# Altium schematic sheet Address Termination.SchDoc
size A3
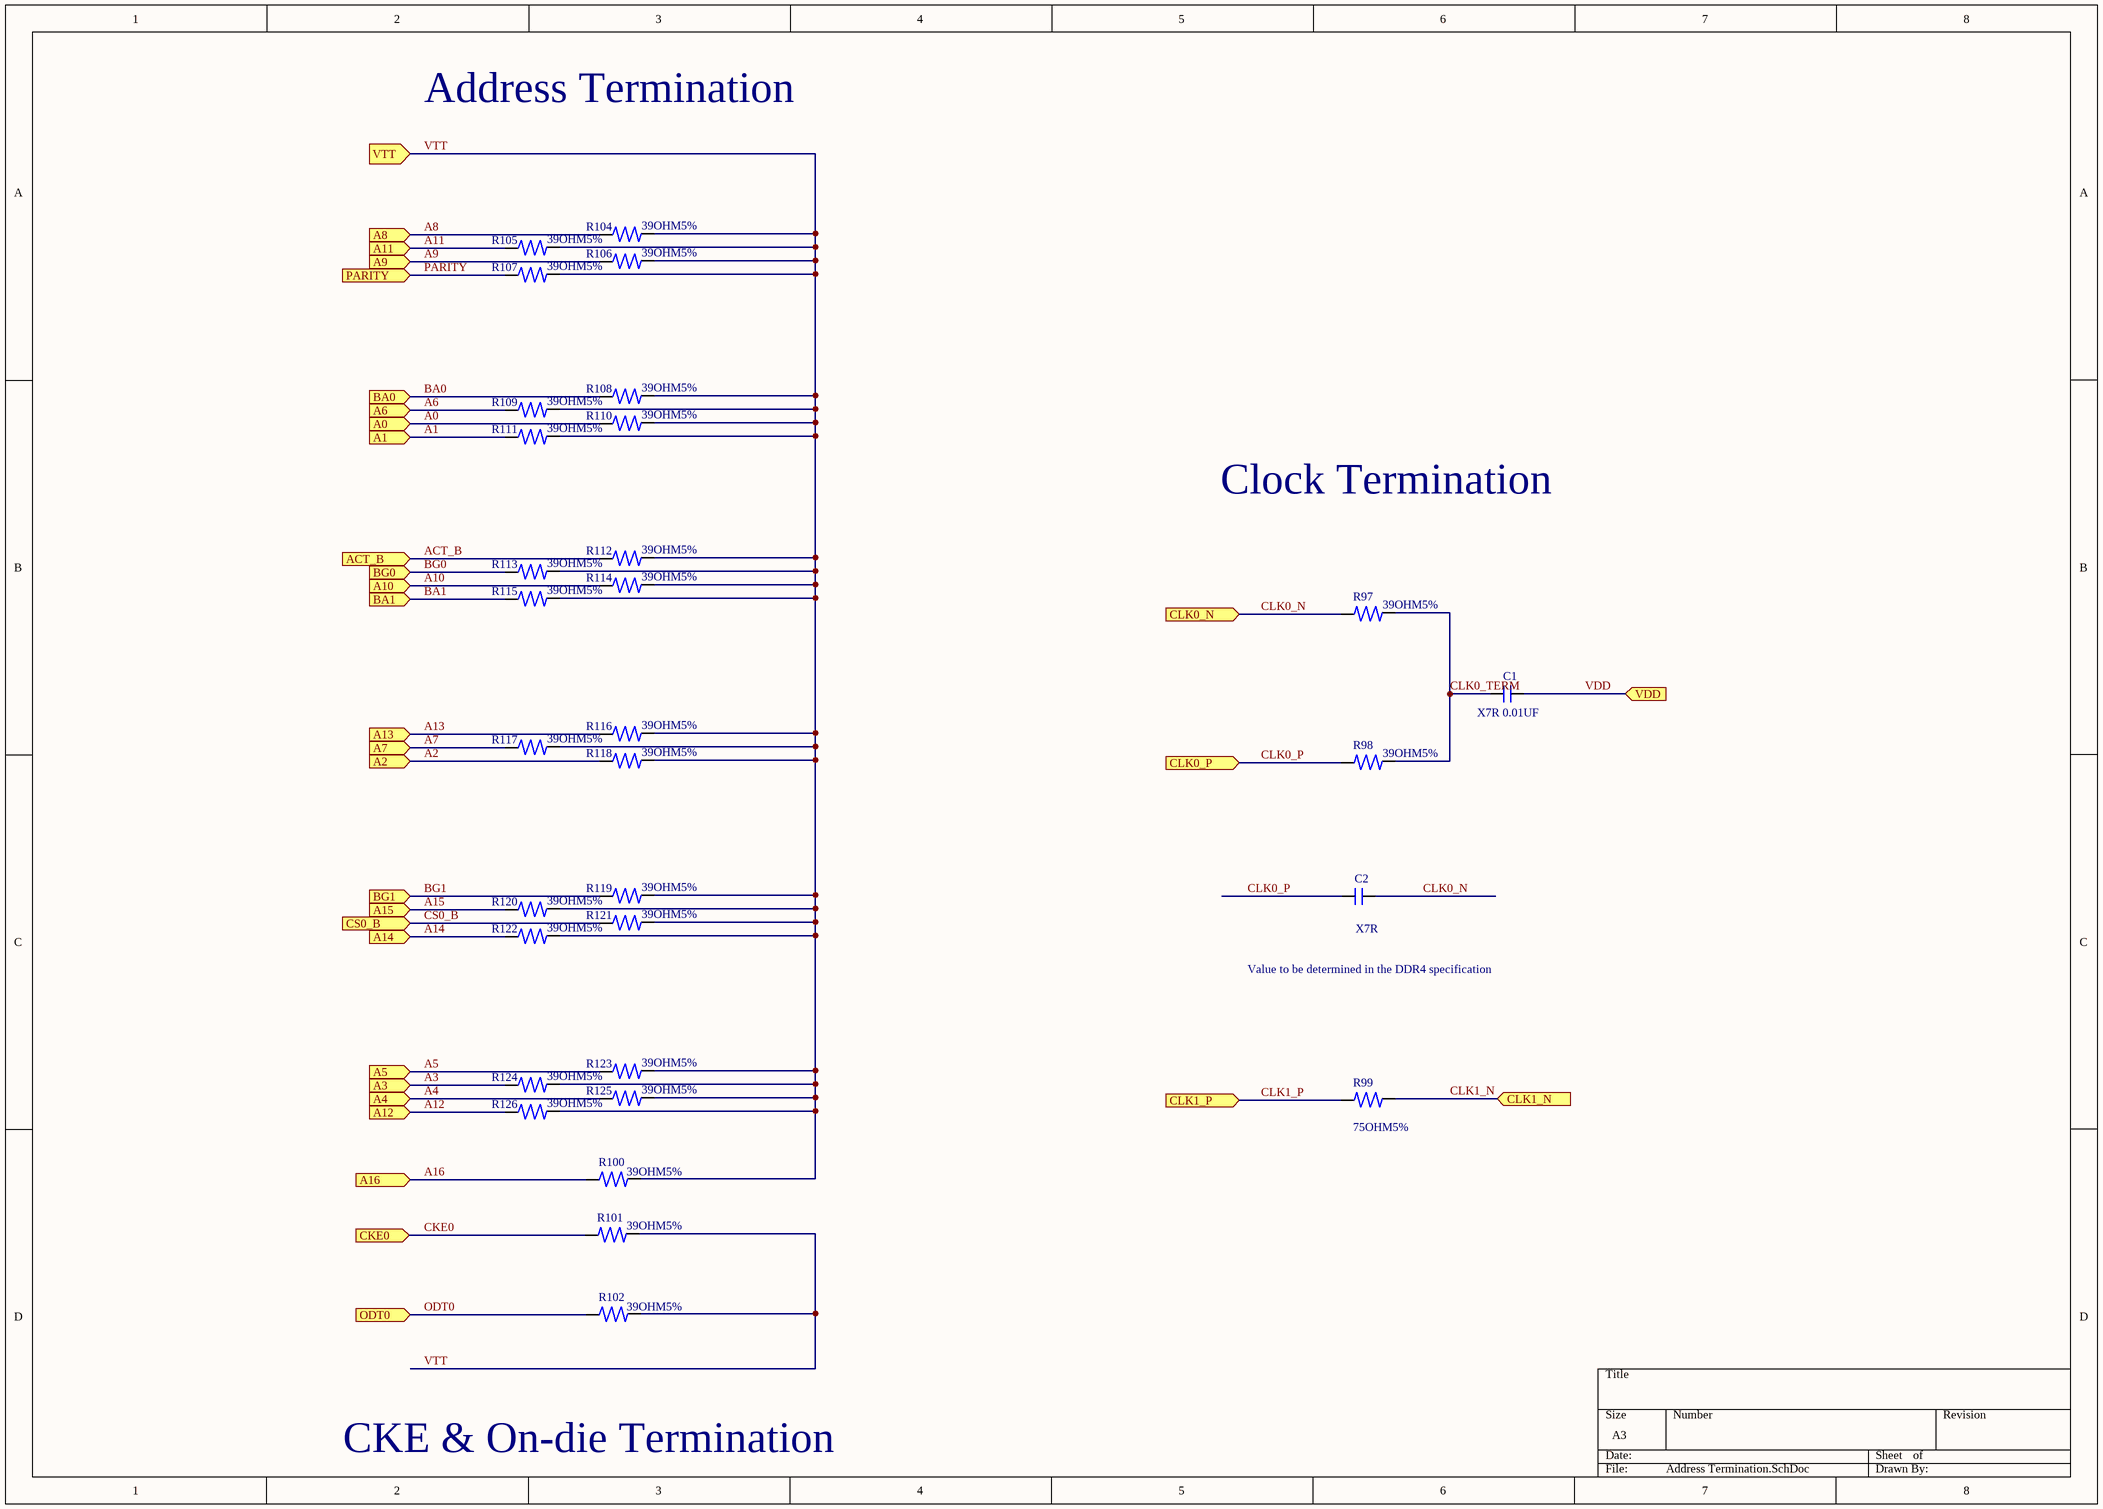
[diagram p0: Address Termination.SchDoc]

## Parts
C1  Capacitance: X7R 0.01UF  [Capacitor 0402]  (hidden comment: Capacitor 0402)
C2  Capacitance: X7R  [Capacitor 0402]  (hidden comment: Capacitor 0402)
R97  Resistance: 39OHM5%  [Resistor 0402]  (hidden comment: Resistor 0402)
R98  Resistance: 39OHM5%  [Resistor 0402]  (hidden comment: Resistor 0402)
R99  Resistance: 75OHM5%  [Resistor 0402]  (hidden comment: Resistor 0402)
R100  Resistance: 39OHM5%  [Resistor 0402]  (hidden comment: Resistor 0402)
R101  Resistance: 39OHM5%  [Resistor 0402]  (hidden comment: Resistor 0402)
R102  Resistance: 39OHM5%  [Resistor 0402]  (hidden comment: Resistor 0402)
R104  Resistance: 39OHM5%  [Resistor 0402]  (hidden comment: Resistor 0402)
R105  Resistance: 39OHM5%  [Resistor 0402]  (hidden comment: Resistor 0402)
R106  Resistance: 39OHM5%  [Resistor 0402]  (hidden comment: Resistor 0402)
R107  Resistance: 39OHM5%  [Resistor 0402]  (hidden comment: Resistor 0402)
R108  Resistance: 39OHM5%  [Resistor 0402]  (hidden comment: Resistor 0402)
R109  Resistance: 39OHM5%  [Resistor 0402]  (hidden comment: Resistor 0402)
R110  Resistance: 39OHM5%  [Resistor 0402]  (hidden comment: Resistor 0402)
R111  Resistance: 39OHM5%  [Resistor 0402]  (hidden comment: Resistor 0402)
R112  Resistance: 39OHM5%  [Resistor 0402]  (hidden comment: Resistor 0402)
R113  Resistance: 39OHM5%  [Resistor 0402]  (hidden comment: Resistor 0402)
R114  Resistance: 39OHM5%  [Resistor 0402]  (hidden comment: Resistor 0402)
R115  Resistance: 39OHM5%  [Resistor 0402]  (hidden comment: Resistor 0402)
R116  Resistance: 39OHM5%  [Resistor 0402]  (hidden comment: Resistor 0402)
R117  Resistance: 39OHM5%  [Resistor 0402]  (hidden comment: Resistor 0402)
R118  Resistance: 39OHM5%  [Resistor 0402]  (hidden comment: Resistor 0402)
R119  Resistance: 39OHM5%  [Resistor 0402]  (hidden comment: Resistor 0402)
R120  Resistance: 39OHM5%  [Resistor 0402]  (hidden comment: Resistor 0402)
R121  Resistance: 39OHM5%  [Resistor 0402]  (hidden comment: Resistor 0402)
R122  Resistance: 39OHM5%  [Resistor 0402]  (hidden comment: Resistor 0402)
R123  Resistance: 39OHM5%  [Resistor 0402]  (hidden comment: Resistor 0402)
R124  Resistance: 39OHM5%  [Resistor 0402]  (hidden comment: Resistor 0402)
R125  Resistance: 39OHM5%  [Resistor 0402]  (hidden comment: Resistor 0402)
R126  Resistance: 39OHM5%  [Resistor 0402]  (hidden comment: Resistor 0402)

## Ports
A0 (in), A1 (in), A2 (in), A3 (in), A4 (in), A5 (in), A6 (in), A7 (in), A8 (in), A9 (in), A10 (in), A11 (in), A12 (in), A13 (in), A14 (in), A15 (in), A16 (in), ACT_B (in), BA0 (in), BA1 (in), BG0 (in), BG1 (in), CKE0 (in), CLK0_N (in), CLK0_P (in), CLK1_N (in), CLK1_P (in), CS0_B (in), ODT0 (in), PARITY (in), VDD (in), VTT (in)

## Nets
A0: R110.1 ; port A0
A1: R111.1 ; port A1
A2: R118.1 ; port A2
A3: R124.1 ; port A3
A4: R125.1 ; port A4
A5: R123.1 ; port A5
A6: R109.1 ; port A6
A7: R117.1 ; port A7
A8: R104.1 ; port A8
A9: R106.1 ; port A9
A10: R114.1 ; port A10
A11: R105.1 ; port A11
A12: R126.1 ; port A12
A13: R116.1 ; port A13
A14: R122.1 ; port A14
A15: R120.1 ; port A15
A16: R100.1 ; port A16
ACT_B: R112.1 ; port ACT_B
BA0: R108.1 ; port BA0
BA1: R115.1 ; port BA1
BG0: R113.1 ; port BG0
BG1: R119.1 ; port BG1
CKE0: R101.1 ; port CKE0
CLK0_N: C2.2 R97.1 ; port CLK0_N
CLK0_P: C2.1 R98.1 ; port CLK0_P
CLK0_TERM: C1.1 R97.2 R98.2
CLK1_N: R99.2 ; port CLK1_N
CLK1_P: R99.1 ; port CLK1_P
CS0_B: R121.1 ; port CS0_B
ODT0: R102.1 ; port ODT0
PARITY: R107.1 ; port PARITY
VDD: C1.2 ; port VDD
VTT: R100.2 R101.2 R102.2 R104.2 R105.2 R106.2 R107.2 R108.2 R109.2 R110.2 R111.2 R112.2 R113.2 R114.2 R115.2 R116.2 R117.2 R118.2 R119.2 R120.2 R121.2 R122.2 R123.2 R124.2 R125.2 R126.2 ; port VTT

## Notes on the sheet
- Address Termination
- Clock Termination
- Value to be determined in the DDR4 specification
- CKE & On-die Termination

## Library data of the parts
C1 C2 = Capacitor 0201: Manufacturer: Vishay; Manufacturer Part Number: CRCW060310K0FKEA; Max Power Dissipation: 100mW; Tolerance: 1%; Voltage Rating: 75V; Temperature Coefficient: 100ppm/°C; Supplier 1: Avnet Europe; Stock 1: 305000; Pricing 1: 5000=0.00444, 10000=0.00432, 20000=0.00421, 30000=0.0041, 40000=0.004 (EUR); Case/Package: 0201; Number of Pins: 2; Weight: 7.1E-05oz; Contact Plating: Tin,Lead; Case Code (Metric): 0603; Case Code (Imperial): 0201; Min Operating Temperature: -55°C; Max Operating Temperature: 155°C; Packaging: Tape and Reel; Package Quantity: 10; Termination: SMD/SMT; Power Rating: 100mW; Composition: Thick Film; Number of Terminations: 2; Military Standard: Not; Voltage Rating (DC): 75V; Features: Automotive AEC-Q200; Length: 1.55mm; Height: 0.45mm; Width: 0.033inch; Depth: 0.85mm; Radiation Hardening: No; REACH SVHC: Unknown; Lead Free: Lead Free
R97-R102 R104-R126 = Resistor 0201: Manufacturer: Vishay; Manufacturer Part Number: CRCW060310K0FKEA; Max Power Dissipation: 100mW; Tolerance: 1%; Voltage Rating: 75V; Temperature Coefficient: 100ppm/°C; Supplier 1: Avnet Europe; Stock 1: 305000; Pricing 1: 5000=0.00444, 10000=0.00432, 20000=0.00421, 30000=0.0041, 40000=0.004 (EUR); Case/Package: 0201; Number of Pins: 2; Weight: 7.1E-05oz; Contact Plating: Tin,Lead; Case Code (Metric): 0603; Case Code (Imperial): 0201; Min Operating Temperature: -55°C; Max Operating Temperature: 155°C; Packaging: Tape and Reel; Package Quantity: 10; Termination: SMD/SMT; Power Rating: 100mW; Composition: Thick Film; Number of Terminations: 2; Military Standard: Not; Voltage Rating (DC): 75V; Features: Automotive AEC-Q200; Length: 1.55mm; Height: 0.45mm; Width: 0.033inch; Depth: 0.85mm; Radiation Hardening: No; REACH SVHC: Unknown; Lead Free: Lead Free; ComponentLink1URL: http://www.vishay.com/docs/20008/dcrcw.pdf?src-supplier=Avnet+Europe; ComponentLink1Description: http://www.vishay.com/docs/20008/dcrcw.pdf?src-supplier=Avnet+Europe; ComponentLink2URL: https://www.verical.com/server-webapp/html/getDatasheet?partID=86831&src-supplier=Verical; ComponentLink2Description: https://www.verical.com/server-webapp/html/getDatasheet?partID=86831&src-supplier=Verical; ComponentLink3URL: http://www.farnell.com/datasheets/2310790.pdf?src-supplier=Allied+Electronics; ComponentLink3Description: http://www.farnell.com/datasheets/2310790.pdf?src-supplier=Allied+Electronics; ComponentLink4URL: http://www.vishay.com/docs/20035/dcrcwe3.pdf?src-supplier=Digi-Key; ComponentLink4Description: http://www.vishay.com/docs/20035/dcrcwe3.pdf?src-supplier=Digi-Key; ComponentLink5URL: http://www.farnell.com/datasheets/2310790.pdf?src-supplier=Mouser; ComponentLink5Description: http://www.farnell.com/datasheets/2310790.pdf?src-supplier=Mouser; ComponentLink6URL: http://www.farnell.com/datasheets/2310790.pdf?src-supplier=Element14; ComponentLink6Description: http://www.farnell.com/datasheets/2310790.pdf?src-supplier=Element14; ComponentLink7URL: http://www.farnell.com/datasheets/2310790.pdf?src-supplier=Avnet; ComponentLink7Description: http://www.farnell.com/datasheets/2310790.pdf?src-supplier=Avnet; ComponentLink8URL: http://www.vishay.com/docs/20035/dcrcwe3.pdf?src-supplier=Future+Electronics; ComponentLink8Description: http://www.vishay.com/docs/20035/dcrcwe3.pdf?src-supplier=Future+Electronics; ComponentLink9URL: http://uk.rs-online.com/webdocs/0d98/0900766b80d98afc.pdf?src-supplier=RSComponents; ComponentLink9Description: http://uk.rs-online.com/webdocs/0d98/0900766b80d98afc.pdf?src-supplier=RSComponents; ComponentLink10URL: http://www.farnell.com/datasheets/2310790.pdf?src-supplier=Distrelec; ComponentLink10Description: http://www.farnell.com/datasheets/2310790.pdf?src-supplier=Distrelec